# Altium project span-ion-cfd-respin-noMuxDemux.PrjPcb
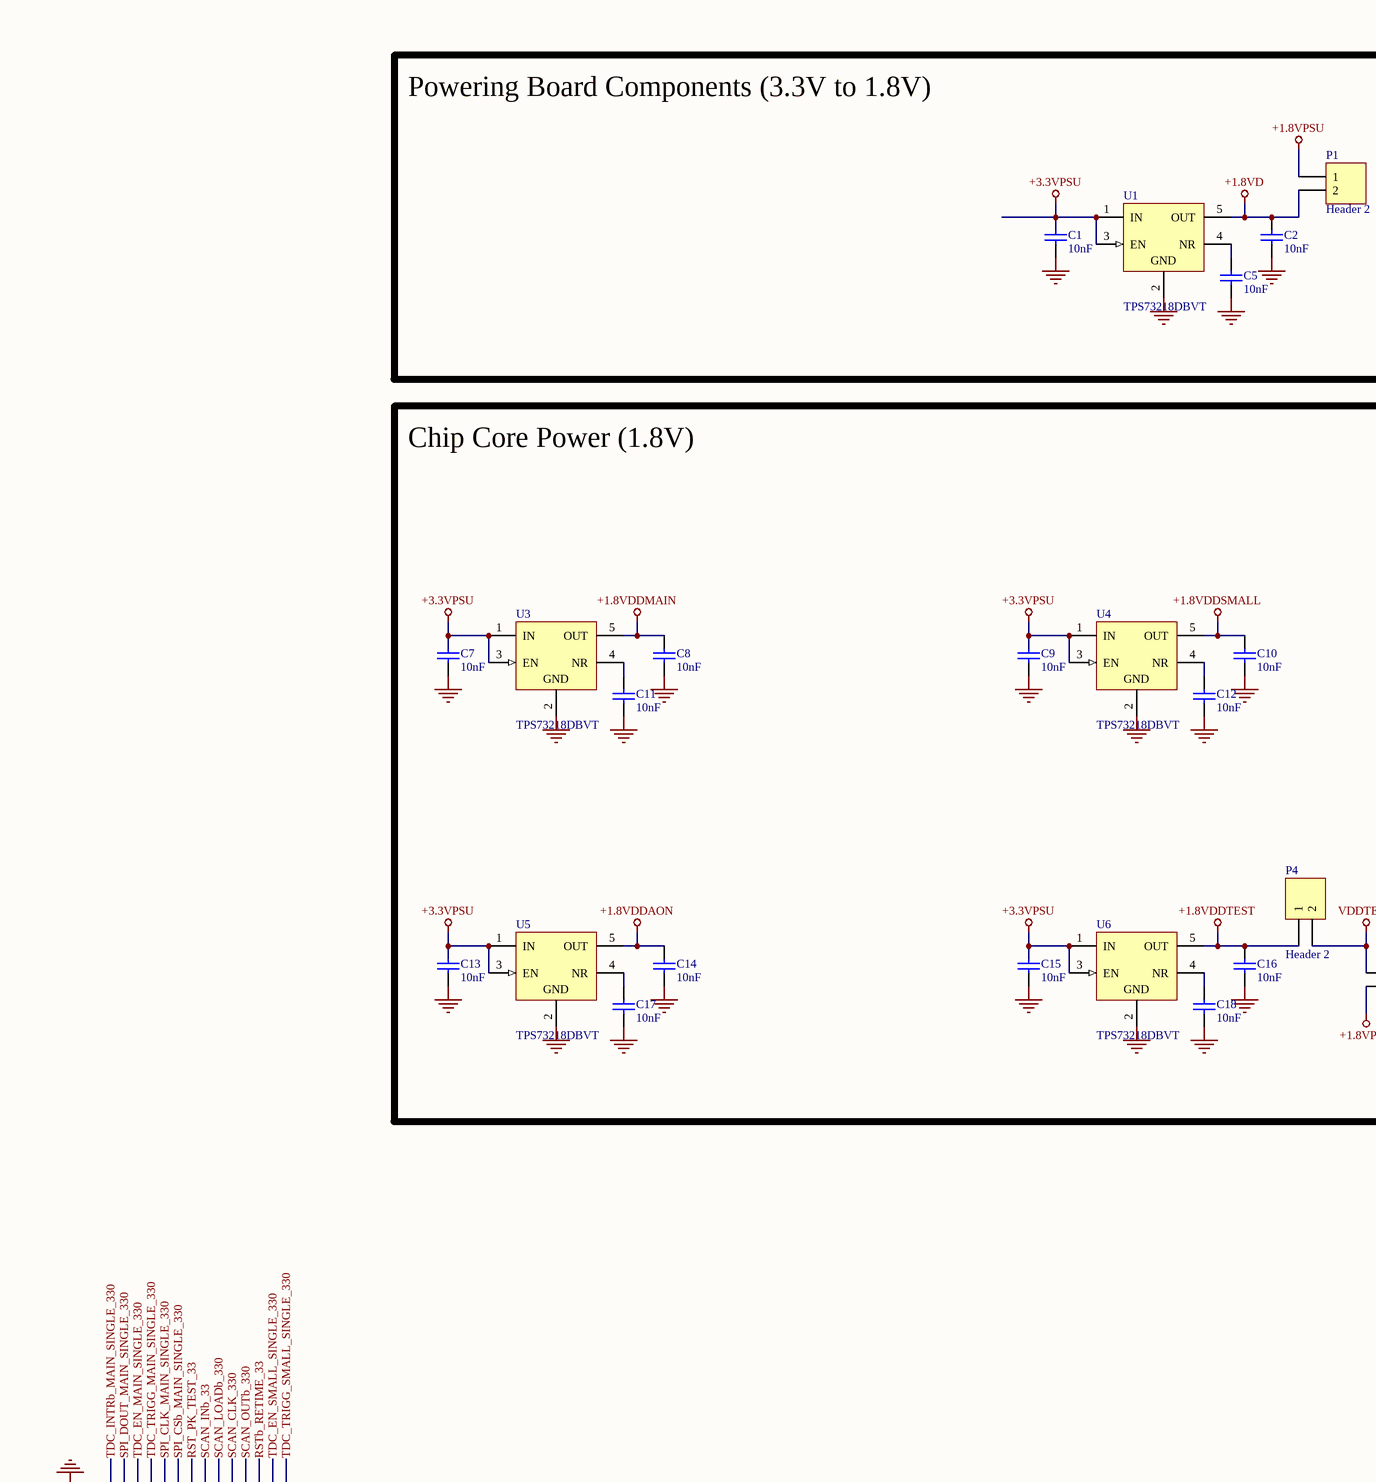
[diagram p0: Shared.SchDoc, top left]
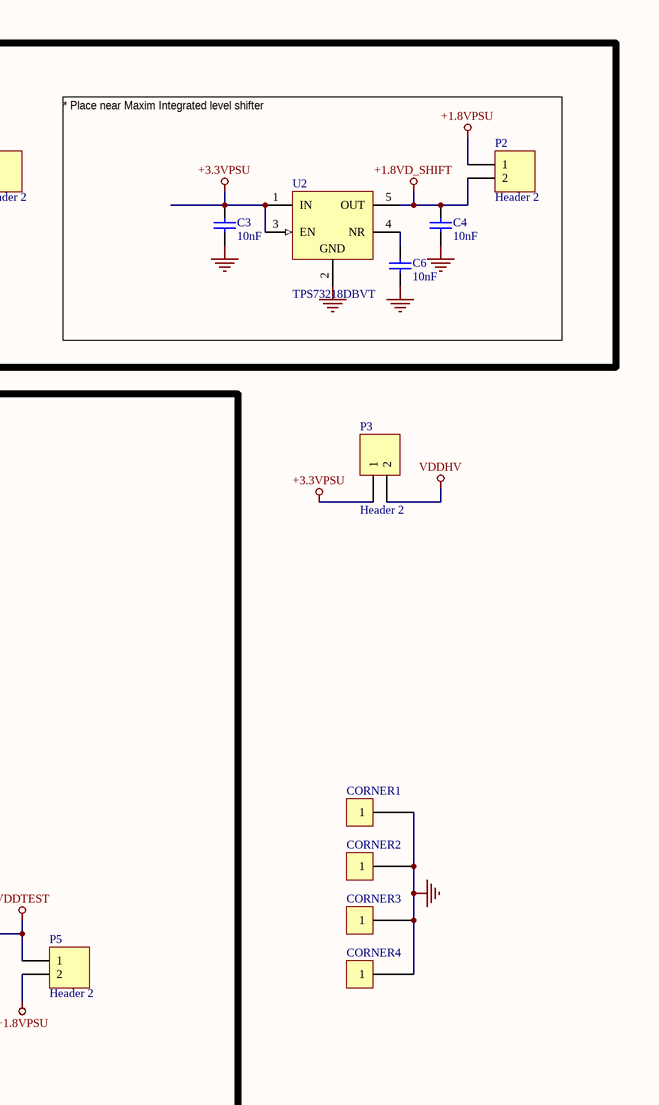
[diagram p1: Shared.SchDoc, top right]
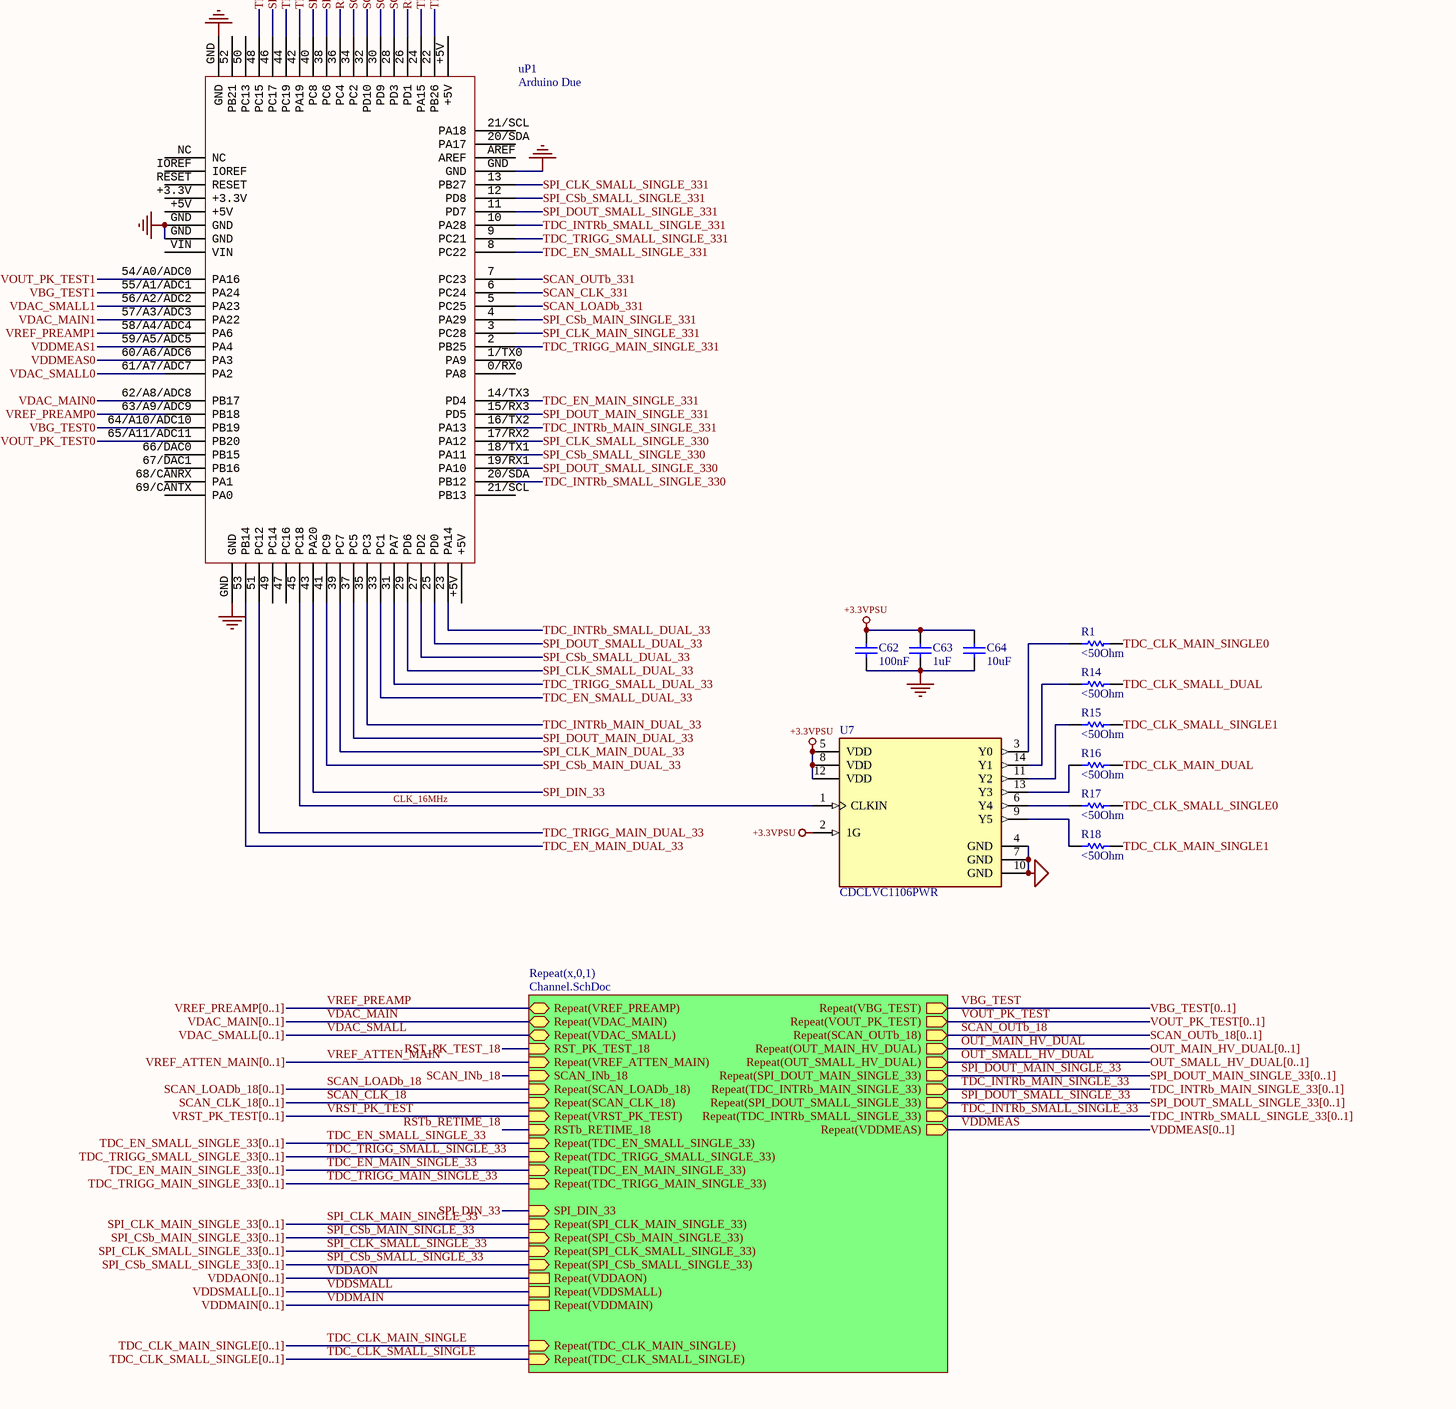
[diagram p2: Shared.SchDoc, bottom left]
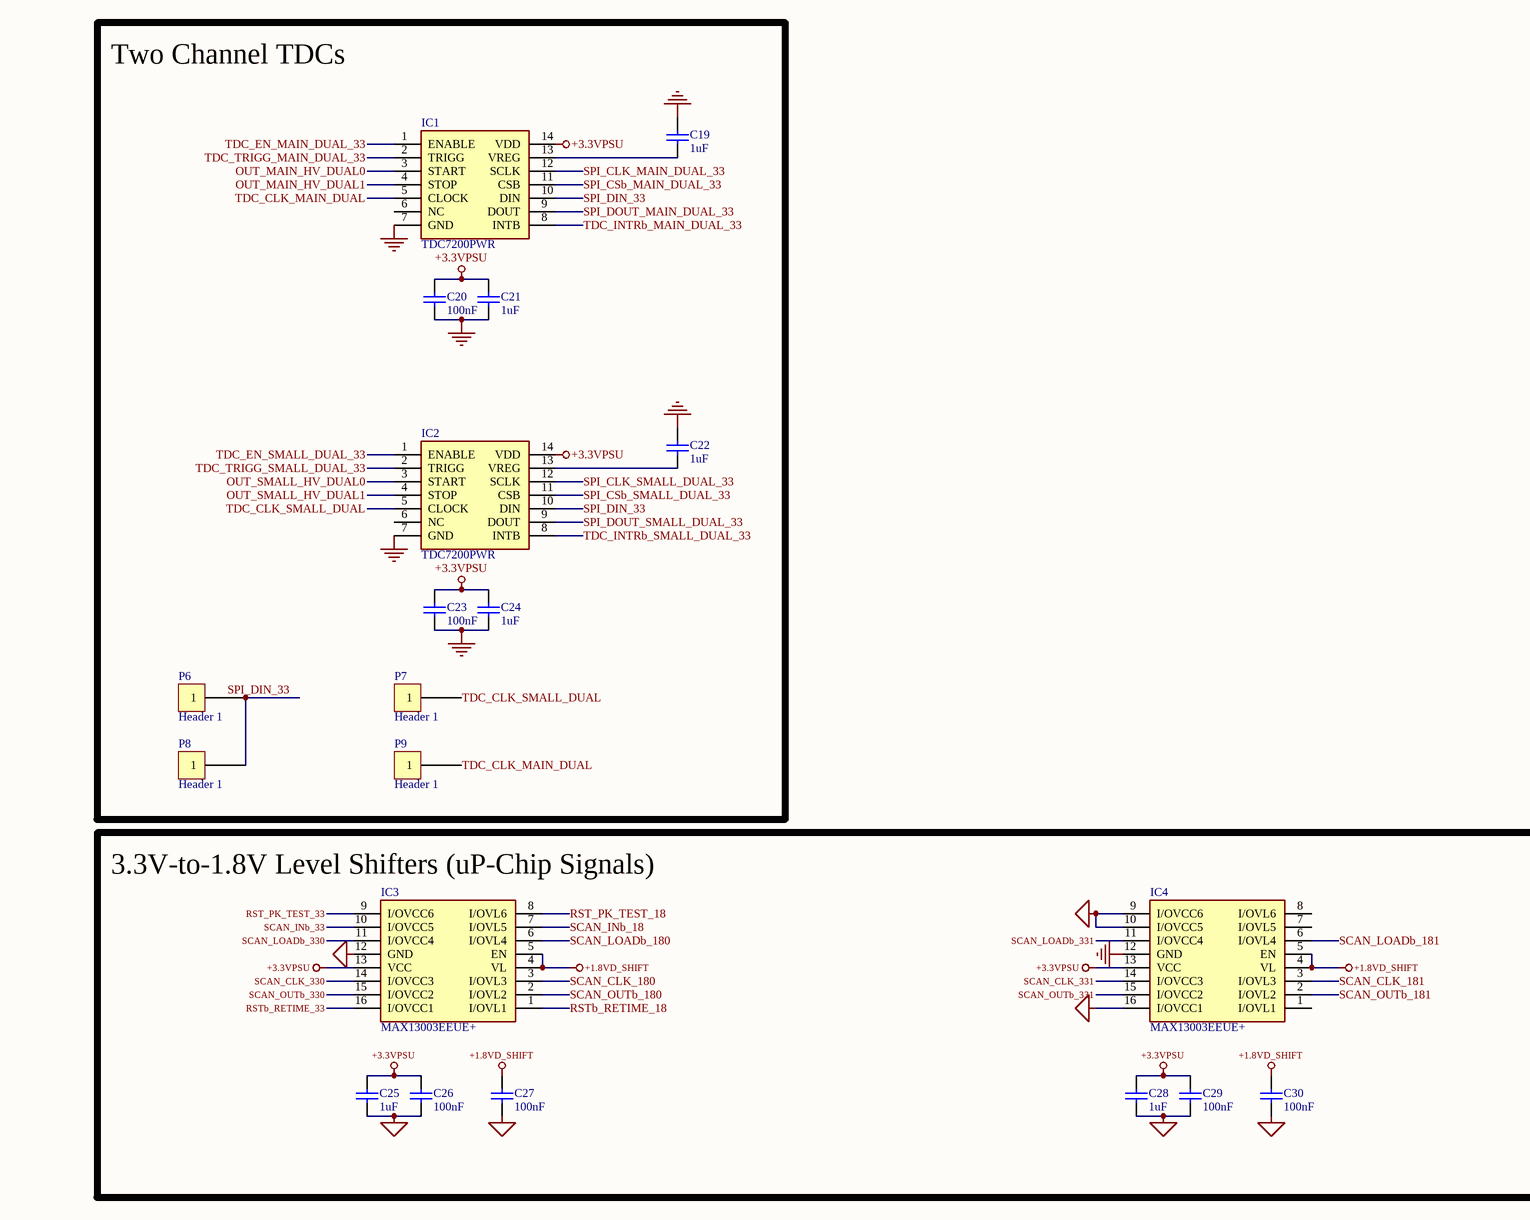
[diagram p3: Shared.SchDoc, bottom right]
2 sheets, 216 parts. Net scope: hierarchical (ports join the sheet entries above them; power ports are global).
Board file: CFD_2Channel.PcbDoc
Sheets:
  Shared.SchDoc
    x0 = Channel.SchDoc
    x1 = Channel.SchDoc

## Sheet Shared.SchDoc
size OrCAD E; SheetNumber: 1; SheetTotal: 2

### Parts
C1  10nF  [CAPC1608X90X35ML10T15]
C2  10nF  [CAPC1608X90X35ML10T15]
C3  10nF  [CAPC1608X90X35ML10T15]
C4  10nF  [CAPC1608X90X35ML10T15]
C5  10nF  [CAPC1608X90X35ML10T15]
C6  10nF  [CAPC1608X90X35ML10T15]
C7  10nF  [CAPC1608X90X35ML10T15]
C8  10nF  [CAPC1608X90X35ML10T15]
C9  10nF  [CAPC1608X90X35ML10T15]
C10  10nF  [CAPC1608X90X35ML10T15]
C11  10nF  [CAPC1608X90X35ML10T15]
C12  10nF  [CAPC1608X90X35ML10T15]
C13  10nF  [CAPC1608X90X35ML10T15]
C14  10nF  [CAPC1608X90X35ML10T15]
C15  10nF  [CAPC1608X90X35ML10T15]
C16  10nF  [CAPC1608X90X35ML10T15]
C17  10nF  [CAPC1608X90X35ML10T15]
C18  10nF  [CAPC1608X90X35ML10T15]
C19  1uF  [CAPC1608X90X35ML10T15]
C20  100nF  [CAPC1608X90X35ML10T15]
C21  1uF  [CAPC1608X90X35ML10T15]
C22  1uF  [CAPC1608X90X35ML10T15]
C23  100nF  [CAPC1608X90X35ML10T15]
C24  1uF  [CAPC1608X90X35ML10T15]
C25  1uF  [CAPC1608X90X35ML10T15]
C26  100nF  [CAPC1608X90X35ML10T15]
C27  100nF  [CAPC1608X90X35ML10T15]
C28  1uF  [CAPC1608X90X35ML10T15]
C29  100nF  [CAPC1608X90X35ML10T15]
C30  100nF  [CAPC1608X90X35ML10T15]
C62  100nF  [CAPC1608X90X35ML10T15]
C63  1uF  [CAPC1608X90X35ML10T15]
C64  10uF  [CAPC1608X90X35ML10T15]
CORNER1  Corner Mount  [CornerMount]  (value not drawn)
CORNER2  Corner Mount  [CornerMount]  (value not drawn)
CORNER3  Corner Mount  [CornerMount]  (value not drawn)
CORNER4  Corner Mount  [CornerMount]  (value not drawn)
IC1  TDC7200PWR  [SOP65P640X120-14N]
IC2  TDC7200PWR  [SOP65P640X120-14N]
IC3  MAX13003EEUE+  [SOP65P640X110-16N]
IC4  MAX13003EEUE+  [SOP65P640X110-16N]
P1  Header 2  [HDR1X2]
P2  Header 2  [HDR1X2]
P3  Header 2  [HDR1X2]
P4  Header 2  [HDR1X2]
P5  Header 2  [HDR1X2]
P6  Header 1  [Header1]
P7  Header 1  [Header1]
P8  Header 1  [Header1]
P9  Header 1  [Header1]
R1  <50Ohm  [RESC1609X50X30NL8T20]
R14  <50Ohm  [RESC1609X50X30NL8T20]
R15  <50Ohm  [RESC1609X50X30NL8T20]
R16  <50Ohm  [RESC1609X50X30NL8T20]
R17  <50Ohm  [RESC1609X50X30NL8T20]
R18  <50Ohm  [RESC1609X50X30NL8T20]
U1  TPS73218DBVT  [DBV0005A_N]
U2  TPS73218DBVT  [DBV0005A_N]
U3  TPS73218DBVT  [DBV0005A_N]
U4  TPS73218DBVT  [DBV0005A_N]
U5  TPS73218DBVT  [DBV0005A_N]
U6  TPS73218DBVT  [DBV0005A_N]
U7  CDCLVC1106PWR  [FP-PW0014A-MFG]
uP1  Arduino Due  [Arduino Due]

### Blocks framed on the sheet
Powering Board Components (3.3V to 1.8V): C1-C6 P1 P2 U1 U2
Chip Core Power (1.8V): C7-C18 P4 P5 U3-U6
Two Channel TDCs: C19-C24 IC1 IC2 P6-P9
3.3V-to-1.8V Level Shifters (uP-Chip Signals): C25-C30 IC3 IC4

### Sub-sheets
Repeat(x,0,1) = Channel.SchDoc: Repeat(VREF_PREAMP) (bidir), Repeat(VDAC_MAIN) (bidir), Repeat(VDAC_SMALL) (bidir), RST_PK_TEST_18 (in), Repeat(VREF_ATTEN_MAIN) (in), SCAN_INb_18 (in), Repeat(SCAN_LOADb_18) (in), Repeat(VBG_TEST) (out), Repeat(VOUT_PK_TEST) (out), Repeat(SCAN_CLK_18) (in), Repeat(VRST_PK_TEST) (in), Repeat(SCAN_OUTb_18) (out), Repeat(OUT_MAIN_HV_DUAL) (out), Repeat(OUT_SMALL_HV_DUAL) (out), RSTb_RETIME_18 (in), Repeat(TDC_EN_SMALL_SINGLE_33) (in), Repeat(TDC_TRIGG_SMALL_SINGLE_33) (in), Repeat(TDC_EN_MAIN_SINGLE_33) (in), Repeat(TDC_TRIGG_MAIN_SINGLE_33) (in), SPI_DIN_33 (in), Repeat(SPI_CLK_MAIN_SINGLE_33) (in), Repeat(SPI_DOUT_MAIN_SINGLE_33) (out), Repeat(SPI_CSb_MAIN_SINGLE_33) (in), Repeat(TDC_INTRb_MAIN_SINGLE_33) (out), Repeat(SPI_CLK_SMALL_SINGLE_33) (in), Repeat(SPI_DOUT_SMALL_SINGLE_33) (out), Repeat(SPI_CSb_SMALL_SINGLE_33) (in), Repeat(TDC_INTRb_SMALL_SINGLE_33) (out), Repeat(VDDAON), Repeat(VDDSMALL), Repeat(VDDMAIN), Repeat(VDDMEAS) (out), Repeat(TDC_CLK_MAIN_SINGLE) (in), Repeat(TDC_CLK_SMALL_SINGLE) (in)

### Nets
+1.8VD: C2.1 P1.2 U1.5(OUT)
+1.8VD_SHIFT: C4.1 C27.1 C30.1 IC3.4(VL) IC3.5(EN) IC4.4(VL) IC4.5(EN) P2.2 U2.5(OUT)
+1.8VDDAON: C14.1 U5.5(OUT)
+1.8VDDMAIN: C8.1 U3.5(OUT)
+1.8VDDSMALL: C10.1 U4.5(OUT)
+1.8VDDTEST: C16.1 P4.1 U6.5(OUT)
+1.8VPSU: P1.1 P2.1 P5.2
+3.3VPSU: C1.1 C3.1 C7.1 C9.1 C13.1 C15.1 C20.1 C21.1 C23.1 C24.1 C25.2 C26.2 C28.2 C29.2 C62.1 C63.1 C64.1 IC1.14(VDD) IC2.14(VDD) IC3.13(VCC) IC4.13(VCC) P3.1 U1.1(IN) U1.3(EN) U2.1(IN) U2.3(EN) U3.1(IN) U3.3(EN) U4.1(IN) U4.3(EN) U5.1(IN) U5.3(EN) U6.1(IN) U6.3(EN) U7.2(1G) U7.5(VDD) U7.8(VDD) U7.12(VDD)
GND: C1.2 C2.2 C3.2 C4.2 C5.2 C6.2 C7.2 C8.2 C9.2 C10.2 C11.2 C12.2 C13.2 C14.2 C15.2 C16.2 C17.2 C18.2 C19.2 C20.2 C21.2 C22.2 C23.2 C24.2 C25.1 C26.1 C27.2 C28.1 C29.1 C30.2 C62.2 C63.2 C64.2 CORNER1.1 CORNER2.1 CORNER3.1 CORNER4.1 IC1.7(GND) IC2.7(GND) IC3.12(GND) IC4.9(I/OVCC6) IC4.10(I/OVCC5) IC4.12(GND) IC4.16(I/OVCC1) U1.2(GND) U2.2(GND) U3.2(GND) U4.2(GND) U5.2(GND) U6.2(GND) U7.4(GND) U7.7(GND) U7.10(GND) uP1.GND
VDDHV: P3.2
VDDTEST: P4.2 P5.1
CLK_16MHz: U7.1(CLKIN) uP1.45(PC18)
OUT_MAIN_HV_DUAL: sheet Repeat(x,0,1)/Repeat(OUT_MAIN_HV_DUAL)
OUT_MAIN_HV_DUAL0: IC1.3(START)
OUT_MAIN_HV_DUAL1: IC1.4(STOP)
OUT_SMALL_HV_DUAL: sheet Repeat(x,0,1)/Repeat(OUT_SMALL_HV_DUAL)
OUT_SMALL_HV_DUAL0: IC2.3(START)
OUT_SMALL_HV_DUAL1: IC2.4(STOP)
RST_PK_TEST_18: IC3.8(I/OVL6) ; sheet Repeat(x,0,1)/RST_PK_TEST_18
RST_PK_TEST_33: IC3.9(I/OVCC6) uP1.36(PC4)
RSTb_RETIME_18: IC3.1(I/OVL1) ; sheet Repeat(x,0,1)/RSTb_RETIME_18
RSTb_RETIME_33: IC3.16(I/OVCC1) uP1.26(PD1)
SCAN_CLK_18: sheet Repeat(x,0,1)/Repeat(SCAN_CLK_18)
SCAN_CLK_180: IC3.3(I/OVL3)
SCAN_CLK_181: IC4.3(I/OVL3)
SCAN_CLK_330: IC3.14(I/OVCC3) uP1.30(PD9)
SCAN_CLK_331: IC4.14(I/OVCC3) uP1.6(PC24)
SCAN_INb_18: IC3.7(I/OVL5) ; sheet Repeat(x,0,1)/SCAN_INb_18
SCAN_INb_33: IC3.10(I/OVCC5) uP1.34(PC2)
SCAN_LOADb_18: sheet Repeat(x,0,1)/Repeat(SCAN_LOADb_18)
SCAN_LOADb_180: IC3.6(I/OVL4)
SCAN_LOADb_181: IC4.6(I/OVL4)
SCAN_LOADb_330: IC3.11(I/OVCC4) uP1.32(PD10)
SCAN_LOADb_331: IC4.11(I/OVCC4) uP1.5(PC25)
SCAN_OUTb_18: sheet Repeat(x,0,1)/Repeat(SCAN_OUTb_18)
SCAN_OUTb_180: IC3.2(I/OVL2)
SCAN_OUTb_181: IC4.2(I/OVL2)
SCAN_OUTb_330: IC3.15(I/OVCC2) uP1.28(PD3)
SCAN_OUTb_331: IC4.15(I/OVCC2) uP1.7(PC23)
SPI_CLK_MAIN_DUAL_33: IC1.12(SCLK) uP1.39(PC7)
SPI_CLK_MAIN_SINGLE_33: sheet Repeat(x,0,1)/Repeat(SPI_CLK_MAIN_SINGLE_33)
SPI_CLK_MAIN_SINGLE_330: uP1.40(PC8)
SPI_CLK_MAIN_SINGLE_331: uP1.3(PC28)
SPI_CLK_SMALL_DUAL_33: IC2.12(SCLK) uP1.29(PD6)
SPI_CLK_SMALL_SINGLE_33: sheet Repeat(x,0,1)/Repeat(SPI_CLK_SMALL_SINGLE_33)
SPI_CLK_SMALL_SINGLE_330: uP1.17/RX2(PA12)
SPI_CLK_SMALL_SINGLE_331: uP1.13(PB27)
SPI_CSb_MAIN_DUAL_33: IC1.11(CSB) uP1.41(PC9)
SPI_CSb_MAIN_SINGLE_33: sheet Repeat(x,0,1)/Repeat(SPI_CSb_MAIN_SINGLE_33)
SPI_CSb_MAIN_SINGLE_330: uP1.38(PC6)
SPI_CSb_MAIN_SINGLE_331: uP1.4(PA29)
SPI_CSb_SMALL_DUAL_33: IC2.11(CSB) uP1.27(PD2)
SPI_CSb_SMALL_SINGLE_33: sheet Repeat(x,0,1)/Repeat(SPI_CSb_SMALL_SINGLE_33)
SPI_CSb_SMALL_SINGLE_330: uP1.18/TX1(PA11)
SPI_CSb_SMALL_SINGLE_331: uP1.12(PD8)
SPI_DIN_33: IC1.10(DIN) IC2.10(DIN) P6.1 P8.1 uP1.43(PA20) ; sheet Repeat(x,0,1)/SPI_DIN_33
SPI_DOUT_MAIN_DUAL_33: IC1.9(DOUT) uP1.37(PC5)
SPI_DOUT_MAIN_SINGLE_33: sheet Repeat(x,0,1)/Repeat(SPI_DOUT_MAIN_SINGLE_33)
SPI_DOUT_MAIN_SINGLE_330: uP1.46(PC17)
SPI_DOUT_MAIN_SINGLE_331: uP1.15/RX3(PD5)
SPI_DOUT_SMALL_DUAL_33: IC2.9(DOUT) uP1.25(PD0)
SPI_DOUT_SMALL_SINGLE_33: sheet Repeat(x,0,1)/Repeat(SPI_DOUT_SMALL_SINGLE_33)
SPI_DOUT_SMALL_SINGLE_330: uP1.19/RX1(PA10)
SPI_DOUT_SMALL_SINGLE_331: uP1.11(PD7)
TDC_CLK_MAIN_DUAL: IC1.5(CLOCK) P9.1 R16.1
TDC_CLK_MAIN_SINGLE: sheet Repeat(x,0,1)/Repeat(TDC_CLK_MAIN_SINGLE)
TDC_CLK_MAIN_SINGLE0: R1.1  [project net TDC_CLK_MAIN_SINGLE]
TDC_CLK_MAIN_SINGLE1: R18.1  [project net TDC_CLK_MAIN_SINGLE]
TDC_CLK_SMALL_DUAL: IC2.5(CLOCK) P7.1 R14.1
TDC_CLK_SMALL_SINGLE: sheet Repeat(x,0,1)/Repeat(TDC_CLK_SMALL_SINGLE)
TDC_CLK_SMALL_SINGLE0: R17.1  [project net TDC_CLK_SMALL_SINGLE]
TDC_CLK_SMALL_SINGLE1: R15.1  [project net TDC_CLK_SMALL_SINGLE]
TDC_EN_MAIN_DUAL_33: IC1.1(ENABLE) uP1.53(PB14)
TDC_EN_MAIN_SINGLE_33: sheet Repeat(x,0,1)/Repeat(TDC_EN_MAIN_SINGLE_33)
TDC_EN_MAIN_SINGLE_330: uP1.44(PC19)
TDC_EN_MAIN_SINGLE_331: uP1.14/TX3(PD4)
TDC_EN_SMALL_DUAL_33: IC2.1(ENABLE) uP1.33(PC1)
TDC_EN_SMALL_SINGLE_33: sheet Repeat(x,0,1)/Repeat(TDC_EN_SMALL_SINGLE_33)
TDC_EN_SMALL_SINGLE_330: uP1.24(PA15)
TDC_EN_SMALL_SINGLE_331: uP1.8(PC22)
TDC_INTRb_MAIN_DUAL_33: IC1.8(INTB) uP1.35(PC3)
TDC_INTRb_MAIN_SINGLE_33: sheet Repeat(x,0,1)/Repeat(TDC_INTRb_MAIN_SINGLE_33)
TDC_INTRb_MAIN_SINGLE_330: uP1.48(PC15)
TDC_INTRb_MAIN_SINGLE_331: uP1.16/TX2(PA13)
TDC_INTRb_SMALL_DUAL_33: IC2.8(INTB) uP1.23(PA14)
TDC_INTRb_SMALL_SINGLE_33: sheet Repeat(x,0,1)/Repeat(TDC_INTRb_SMALL_SINGLE_33)
TDC_INTRb_SMALL_SINGLE_330: uP1.20/SDA(PA17)
TDC_INTRb_SMALL_SINGLE_331: uP1.10(PA28)
TDC_TRIGG_MAIN_DUAL_33: IC1.2(TRIGG) uP1.51(PC12)
TDC_TRIGG_MAIN_SINGLE_33: sheet Repeat(x,0,1)/Repeat(TDC_TRIGG_MAIN_SINGLE_33)
TDC_TRIGG_MAIN_SINGLE_330: uP1.42(PA19)
TDC_TRIGG_MAIN_SINGLE_331: uP1.2(PB25)
TDC_TRIGG_SMALL_DUAL_33: IC2.2(TRIGG) uP1.31(PA7)
TDC_TRIGG_SMALL_SINGLE_33: sheet Repeat(x,0,1)/Repeat(TDC_TRIGG_SMALL_SINGLE_33)
TDC_TRIGG_SMALL_SINGLE_330: uP1.22(PB26)
TDC_TRIGG_SMALL_SINGLE_331: uP1.9(PC21)
VBG_TEST: sheet Repeat(x,0,1)/Repeat(VBG_TEST)
VBG_TEST0: uP1.64/A10/ADC10(PB19)  [project net VBG_TEST]
VBG_TEST1: uP1.55/A1/ADC1(PA24)  [project net VBG_TEST]
VDAC_MAIN: sheet Repeat(x,0,1)/Repeat(VDAC_MAIN)
VDAC_MAIN0: uP1.62/A8/ADC8(PB17)  [project net VDAC_MAIN]
VDAC_MAIN1: uP1.57/A3/ADC3(PA22)  [project net VDAC_MAIN]
VDAC_SMALL: sheet Repeat(x,0,1)/Repeat(VDAC_SMALL)
VDAC_SMALL0: uP1.61/A7/ADC7(PA2)  [project net VDAC_SMALL]
VDAC_SMALL1: uP1.56/A2/ADC2(PA23)  [project net VDAC_SMALL]
VDDAON: sheet Repeat(x,0,1)/Repeat(VDDAON)
VDDMAIN: sheet Repeat(x,0,1)/Repeat(VDDMAIN)
VDDMEAS: sheet Repeat(x,0,1)/Repeat(VDDMEAS)
VDDMEAS0: uP1.60/A6/ADC6(PA3)  [project net VDDMEAS]
VDDMEAS1: uP1.59/A5/ADC5(PA4)  [project net VDDMEAS]
VDDSMALL: sheet Repeat(x,0,1)/Repeat(VDDSMALL)
VOUT_PK_TEST: sheet Repeat(x,0,1)/Repeat(VOUT_PK_TEST)
VOUT_PK_TEST0: uP1.65/A11/ADC11(PB20)
VOUT_PK_TEST1: uP1.54/A0/ADC0(PA16)
VREF_ATTEN_MAIN: sheet Repeat(x,0,1)/Repeat(VREF_ATTEN_MAIN)
VREF_PREAMP: sheet Repeat(x,0,1)/Repeat(VREF_PREAMP)
VREF_PREAMP0: uP1.63/A9/ADC9(PB18)  [project net VREF_PREAMP]
VREF_PREAMP1: uP1.58/A4/ADC4(PA6)  [project net VREF_PREAMP]
VRST_PK_TEST: sheet Repeat(x,0,1)/Repeat(VRST_PK_TEST)
NetC5_1: C5.1 U1.4(NR)
NetC6_1: C6.1 U2.4(NR)
NetC11_1: C11.1 U3.4(NR)
NetC12_1: C12.1 U4.4(NR)
NetC17_1: C17.1 U5.4(NR)
NetC18_1: C18.1 U6.4(NR)
NetC19_1: C19.1 IC1.13(VREG)
NetC22_1: C22.1 IC2.13(VREG)
NetR1_2: R1.2 U7.3(Y0)
NetR14_2: R14.2 U7.14(Y1)
NetR15_2: R15.2 U7.11(Y2)
NetR16_2: R16.2 U7.13(Y3)
NetR17_2: R17.2 U7.6(Y4)
NetR18_2: R18.2 U7.9(Y5)

Not connected (* = marked no-connect by the designer): IC1 6(NC); IC2 6(NC); IC4 1(I/OVL1) 7(I/OVL5) 8(I/OVL6); uP1 0/RX0(PA8) 1/TX0(PA9) 21/SCL(PA18) 47(PC16) 49(PC14) 50(PC13) 52(PB21) 66/DAC0(PB15) 67/DAC1(PB16) 68/CANRX(PA1) 69/CANTX(PA0) +3.3V +5V AREF IOREF NC RESET VIN

### Buses and harness runs
bus OUT_MAIN_HV_DUAL[0..1]
bus OUT_SMALL_HV_DUAL[0..1]
bus SCAN_CLK_18[0..1]
bus SCAN_LOADb_18[0..1]
bus SCAN_OUTb_18[0..1]
bus SPI_CLK_MAIN_SINGLE_33[0..1]
bus SPI_CLK_SMALL_SINGLE_33[0..1]
bus SPI_CSb_MAIN_SINGLE_33[0..1]
bus SPI_CSb_SMALL_SINGLE_33[0..1]
bus SPI_DOUT_MAIN_SINGLE_33[0..1]
bus SPI_DOUT_SMALL_SINGLE_33[0..1]
bus TDC_CLK_MAIN_SINGLE[0..1]
bus TDC_CLK_SMALL_SINGLE[0..1]
bus TDC_EN_MAIN_SINGLE_33[0..1]
bus TDC_EN_SMALL_SINGLE_33[0..1]
bus TDC_INTRb_MAIN_SINGLE_33[0..1]
bus TDC_INTRb_SMALL_SINGLE_33[0..1]
bus TDC_TRIGG_MAIN_SINGLE_33[0..1]
bus TDC_TRIGG_SMALL_SINGLE_33[0..1]
bus VBG_TEST[0..1]
bus VDAC_MAIN[0..1]
bus VDAC_SMALL[0..1]
bus VDDAON[0..1]
bus VDDMAIN[0..1]
bus VDDMEAS[0..1]
bus VDDSMALL[0..1]
bus VOUT_PK_TEST[0..1]
bus VREF_ATTEN_MAIN[0..1]
bus VREF_PREAMP[0..1]
bus VRST_PK_TEST[0..1]

### Notes on the sheet
- * Place near Maxim Integrated level shifter

### Library data of the parts
C1-C18 = CMP-2000-04945-1: 0603,10nF; Manufacturer: Murata; Capacitance: 22pF; Tolerance (%): ±5%; Rated Voltage: 50V; Dielectric: C0G; Manufacturer URL: http://www.murata.com/; Datasheet Version: Jul-06; Package Reference: 603; Case Size/Dimension: 0603; Package Description: 2-Pin Surface Mount Device, Body 1.6 x 0.8 mm; Datasheet URL: https://datasheet.ciiva.com/11786/0900766b807a1cab-11786398.pdf
C19 C21 C22 C24 C25 C28 C63 = CMP-2000-04945-1: 0603,1uF; Manufacturer: Murata; Capacitance: 22pF; Tolerance (%): ±5%; Rated Voltage: 50V; Dielectric: C0G; Manufacturer URL: http://www.murata.com/; Datasheet Version: Jul-06; Package Reference: 603; Case Size/Dimension: 0603; Package Description: 2-Pin Surface Mount Device, Body 1.6 x 0.8 mm; Datasheet URL: https://datasheet.ciiva.com/11786/0900766b807a1cab-11786398.pdf
C20 C23 C26 C27 C29 C30 C62 = CMP-2000-04945-1: 0603,100nF; Manufacturer: Murata; Capacitance: 22pF; Tolerance (%): ±5%; Rated Voltage: 50V; Dielectric: C0G; Manufacturer URL: http://www.murata.com/; Datasheet Version: Jul-06; Package Reference: 603; Case Size/Dimension: 0603; Package Description: 2-Pin Surface Mount Device, Body 1.6 x 0.8 mm; Datasheet URL: https://datasheet.ciiva.com/11786/0900766b807a1cab-11786398.pdf
C64 = CMP-2000-04945-1: 0603,10uF; Manufacturer: Murata; Capacitance: 22pF; Tolerance (%): ±5%; Rated Voltage: 50V; Dielectric: C0G; Manufacturer URL: http://www.murata.com/; Datasheet Version: Jul-06; Package Reference: 603; Case Size/Dimension: 0603; Package Description: 2-Pin Surface Mount Device, Body 1.6 x 0.8 mm; Datasheet URL: https://datasheet.ciiva.com/11786/0900766b807a1cab-11786398.pdf
IC1 IC2 = TDC7200PWR: Integrated Circuit; Manufacturer_Name: Texas Instruments; Datasheet Link: http://www.ti.com/lit/gpn/tdc7200; Height: 1.2mm; Manufacturer_Part_Number: TDC7200PWR
IC3 IC4 = MAX13003EEUE+: Integrated Circuit; Manufacturer_Name: Maxim Integrated; Datasheet Link: https://pdfserv.maximintegrated.com/en/ds/MAX13000E-MAX13005E.pdf; Height: 1.1mm; Manufacturer_Part_Number: MAX13003EEUE+
P1-P5 = Header 2: Header, 2-Pin; LatestRevisionDate: 17-Jul-2002; LatestRevisionNote: Re-released for DXP Platform.; Publisher: Altium Limited
R1 R14-R18 = CMP-2000-03816-5: 0603,<50Ohm; Manufacturer: Vishay Semiconductor; Voltage Rating: 75 V; Package Quantity: 5000; DatasheetVersion: 06/2012; Min Operating Temperature: -55 degC; ComponentLink1URL: http://www.vishay.com/; Mounting Technology: Surface Mount; Height: 0.45 mm; ComponentLink1Description: Manufacturer URL; REACH SVHC: Unknown; PackageReference: 0603; Packaging: Tape and Reel; Max Operating Temperature: 155 degC; Mount: Surface Mount; ComponentLink2Description: Datasheet; PackageDescription: 2-Pin Surface Mount Device, Body 1.575 x 0.85 mm; Length: 1.55 mm; ComponentLink2URL: http://www.vishay.com/docs/20035/dcrcwe3.pdf; Pins: 2; RoHSCompliant: true
U1-U6 = CMP-0394-00378-2: Single Output Fast Transient Response LDO, 200 mA, Fixed 1.8 V Output, 1.7 to 5.5 V Input, with Reverse Current Protection, 5-pin SOT-23 (DBV), -40 to 85 degC, Green (RoHS & no Sb/Br); Manufacturer: Texas Instruments; Iout(Max)(A): 0.25; Iq(Typ)(mA): 0.4; Accuracy(%): 1; Vout Adj(Min)(V): 1.8; Vdo(Typ)(mV): 40; SubFamily: Single Channel LDO; Vin(Min)(V): 1.7; Vin(Max)(V): 5.5; ComponentLink1URL: http://www.ti.com/; PartNumber: TPS73218DBVT; Eco-Plan: Green (RoHS & no Sb/Br); ComponentLink2Description: Datasheet; PackageVersion: 4073253-4/K; ComponentLink3URL: http://www.ti.com/litv/pdf/mpds018i; ComponentLink3Description: Package Specification; ComponentLink1Description: Manufacturer URL; Vout Adj(Max)(V): 1.8; Code_JEDEC: MO-178; ComponentLink2URL: http://www.ti.com/general/docs/lit/getliterature.tsp?genericPartNumber=TPS73218&fileType=pdf; DatasheetVersion: SBVS037O; Mounting Technology: Surface Mount; PackageReference: DBV0005A; PackageDescription: 5-Pin Plastic Small Outline, Body 1.60 Ãƒâ€” 2.90 mm, Pitch 0.95 mm; Fixed Output Options(V): 1.8
U7 = CMP-04855-000003-1: IC CLK BUFFER 1:6 250MHZ 14TSSOP; Manufacturer: Texas Instruments; Max Supply Voltage: 3.6V; Max Junction Temp: +125°C; Standoff Height: 0.05mm; Number Of Outputs: 6; Number Of Inputs: 1; Nominal Supply Current: 3-6mA; Propagation Delay: 2-2.6ns; Min Supply Voltage: 2.3V; Mouser Description: Clock Buffer Lo Jitter 1:6 LVCMOS Fan-out Clock Bfr; Temperature Range High: +85°C; Device Class L1: Integrated Circuits (ICs); Package: PW0014A; ComponentLink2URL: http://www.ti.com/lit/ds/symlink/cdclvc1106.pdf; Temperature: -40°C to +85°C; Device Class L3: Clock Buffers; Manufacturer Part Number: CDCLVC1106PWR; ComponentLink2Description: Datasheet; Temperature Range Low: -40°C; Category: IC; Ipc Land Pattern Name: SOP65P640X120-14; Height: 1.2mm; Device Class L2: Clock and Timing; RoHS: TRUE; Digikey Description: IC CLK BUFFER 1:6 250MHZ 14TSSOP; Number Of Elements: 1; Lead Free: Yes; Automotive: No; Octopart: https://octopart.com/cdclvc1106pwr-texas+instruments-18629865; Ambient Temperature Range Low: -40°C; Ambient Temperature Range High: +85°C
uP1 = Arduino Due: Header, 10-pin, 8-pin (4x), 18-pin dual row

## Sheet Channel.SchDoc
size OrCAD E; SheetNumber: 2; SheetTotal: 2
Used 2 times, as channels x0, x1. Parts and nets are listed once, with the designators drawn on the sheet.
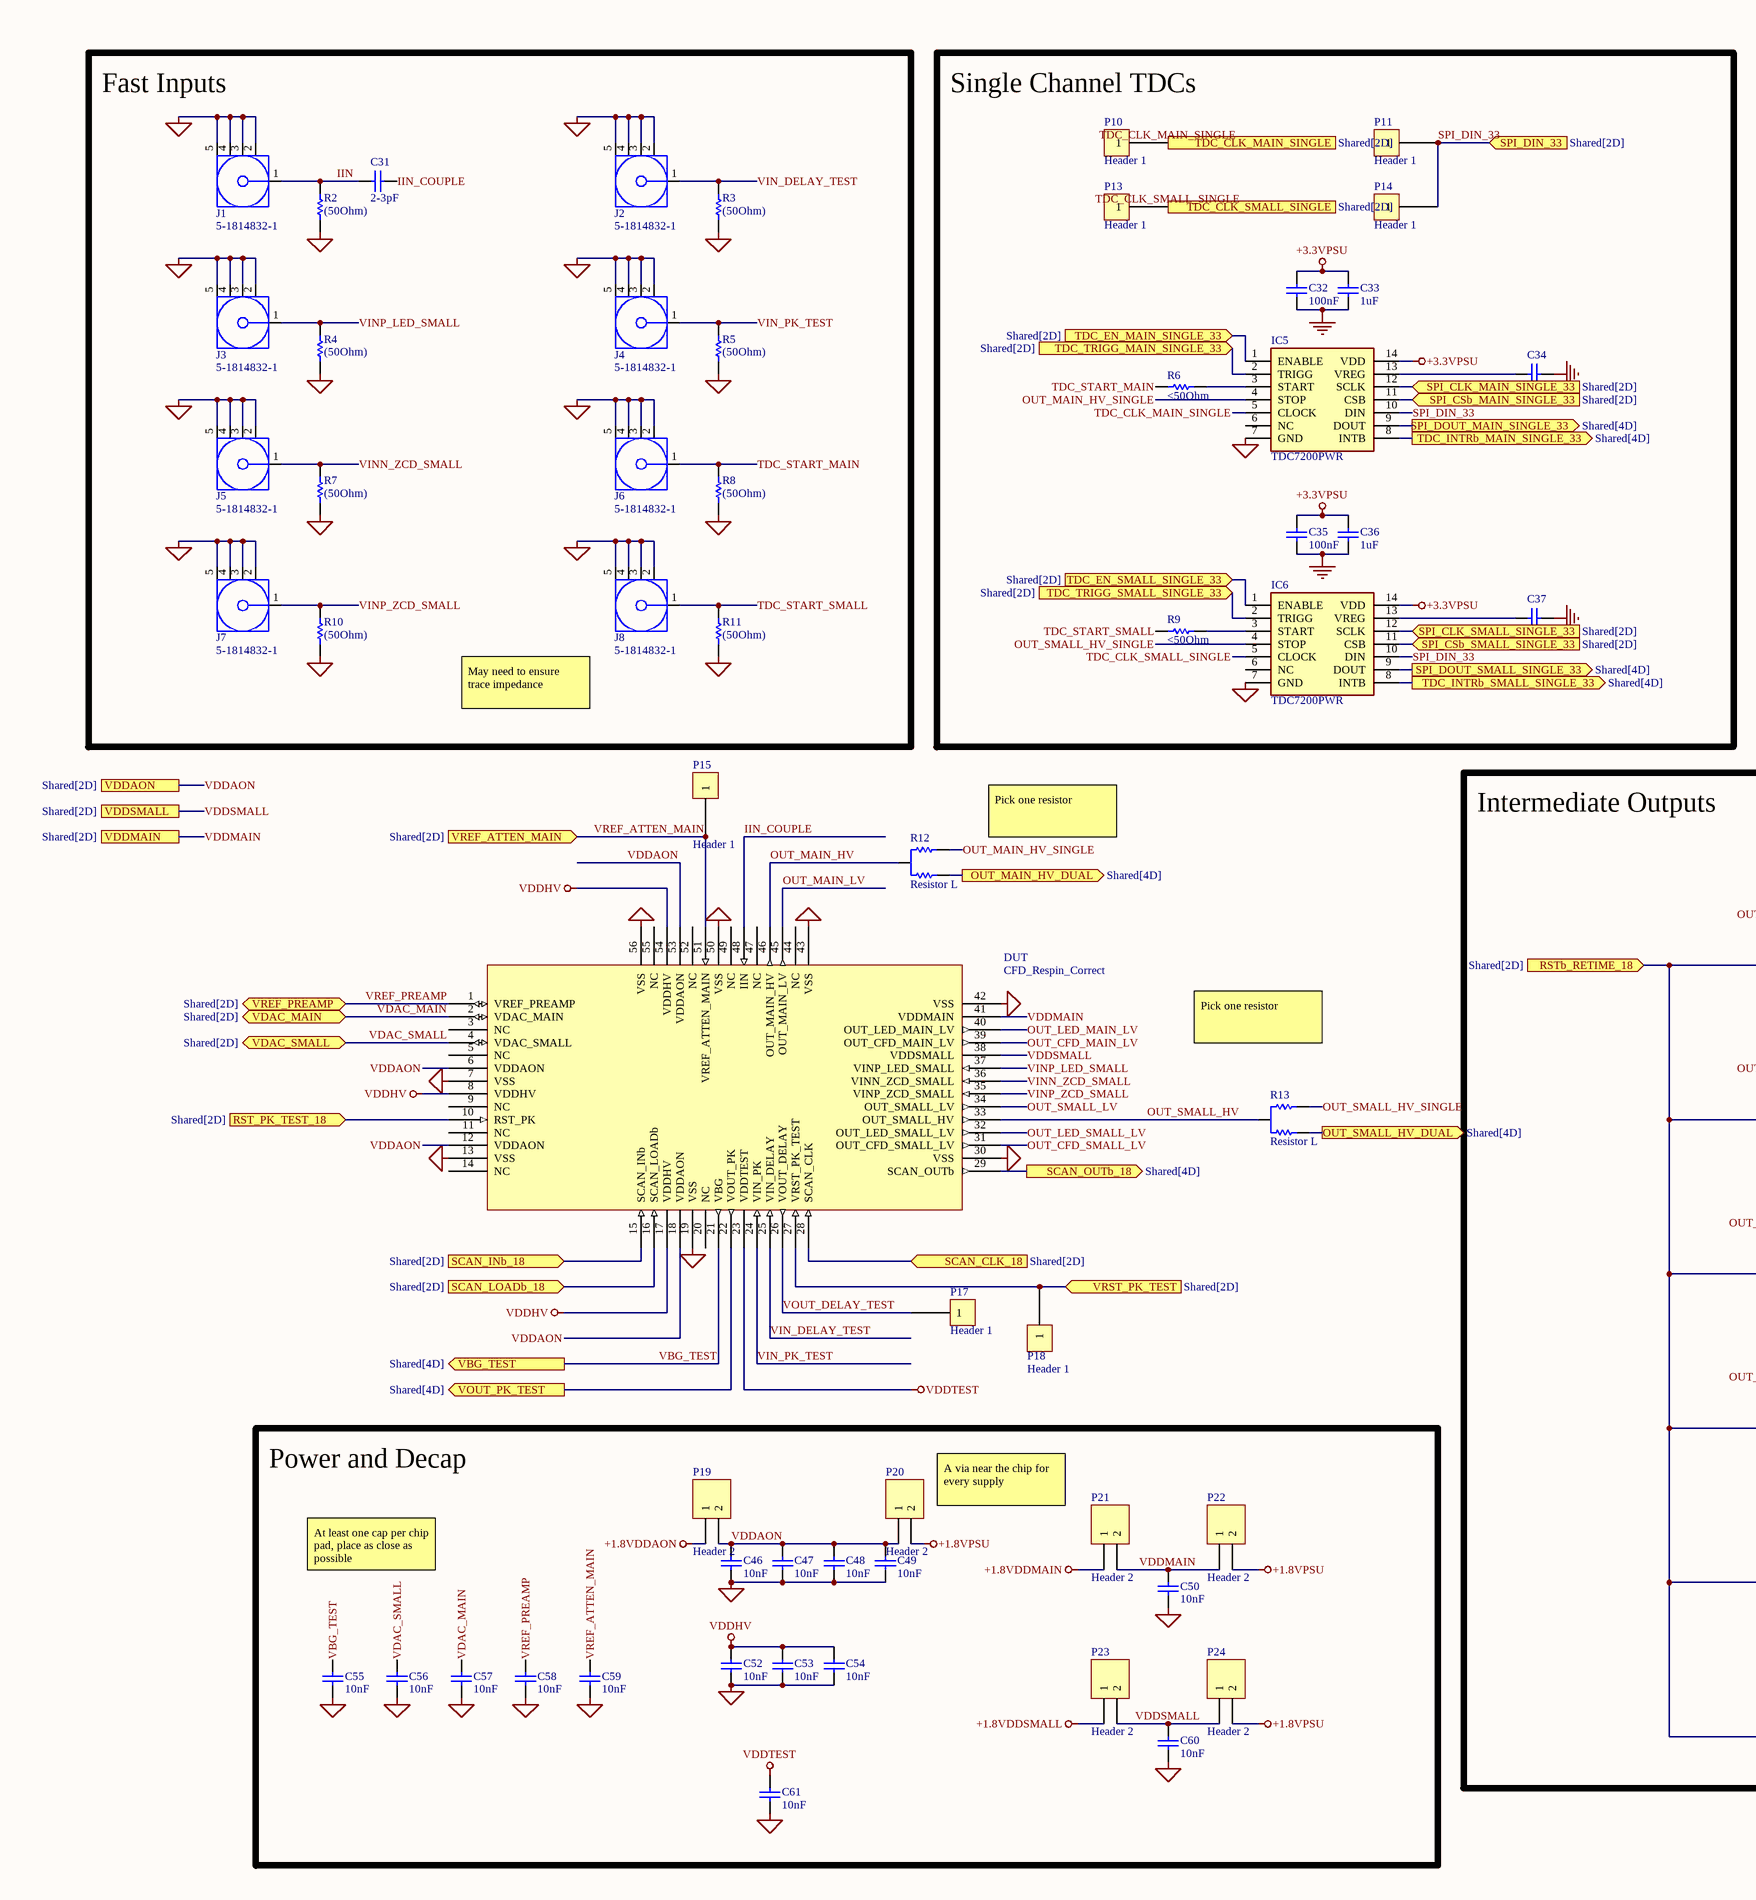
[diagram p4: Channel.SchDoc, left]
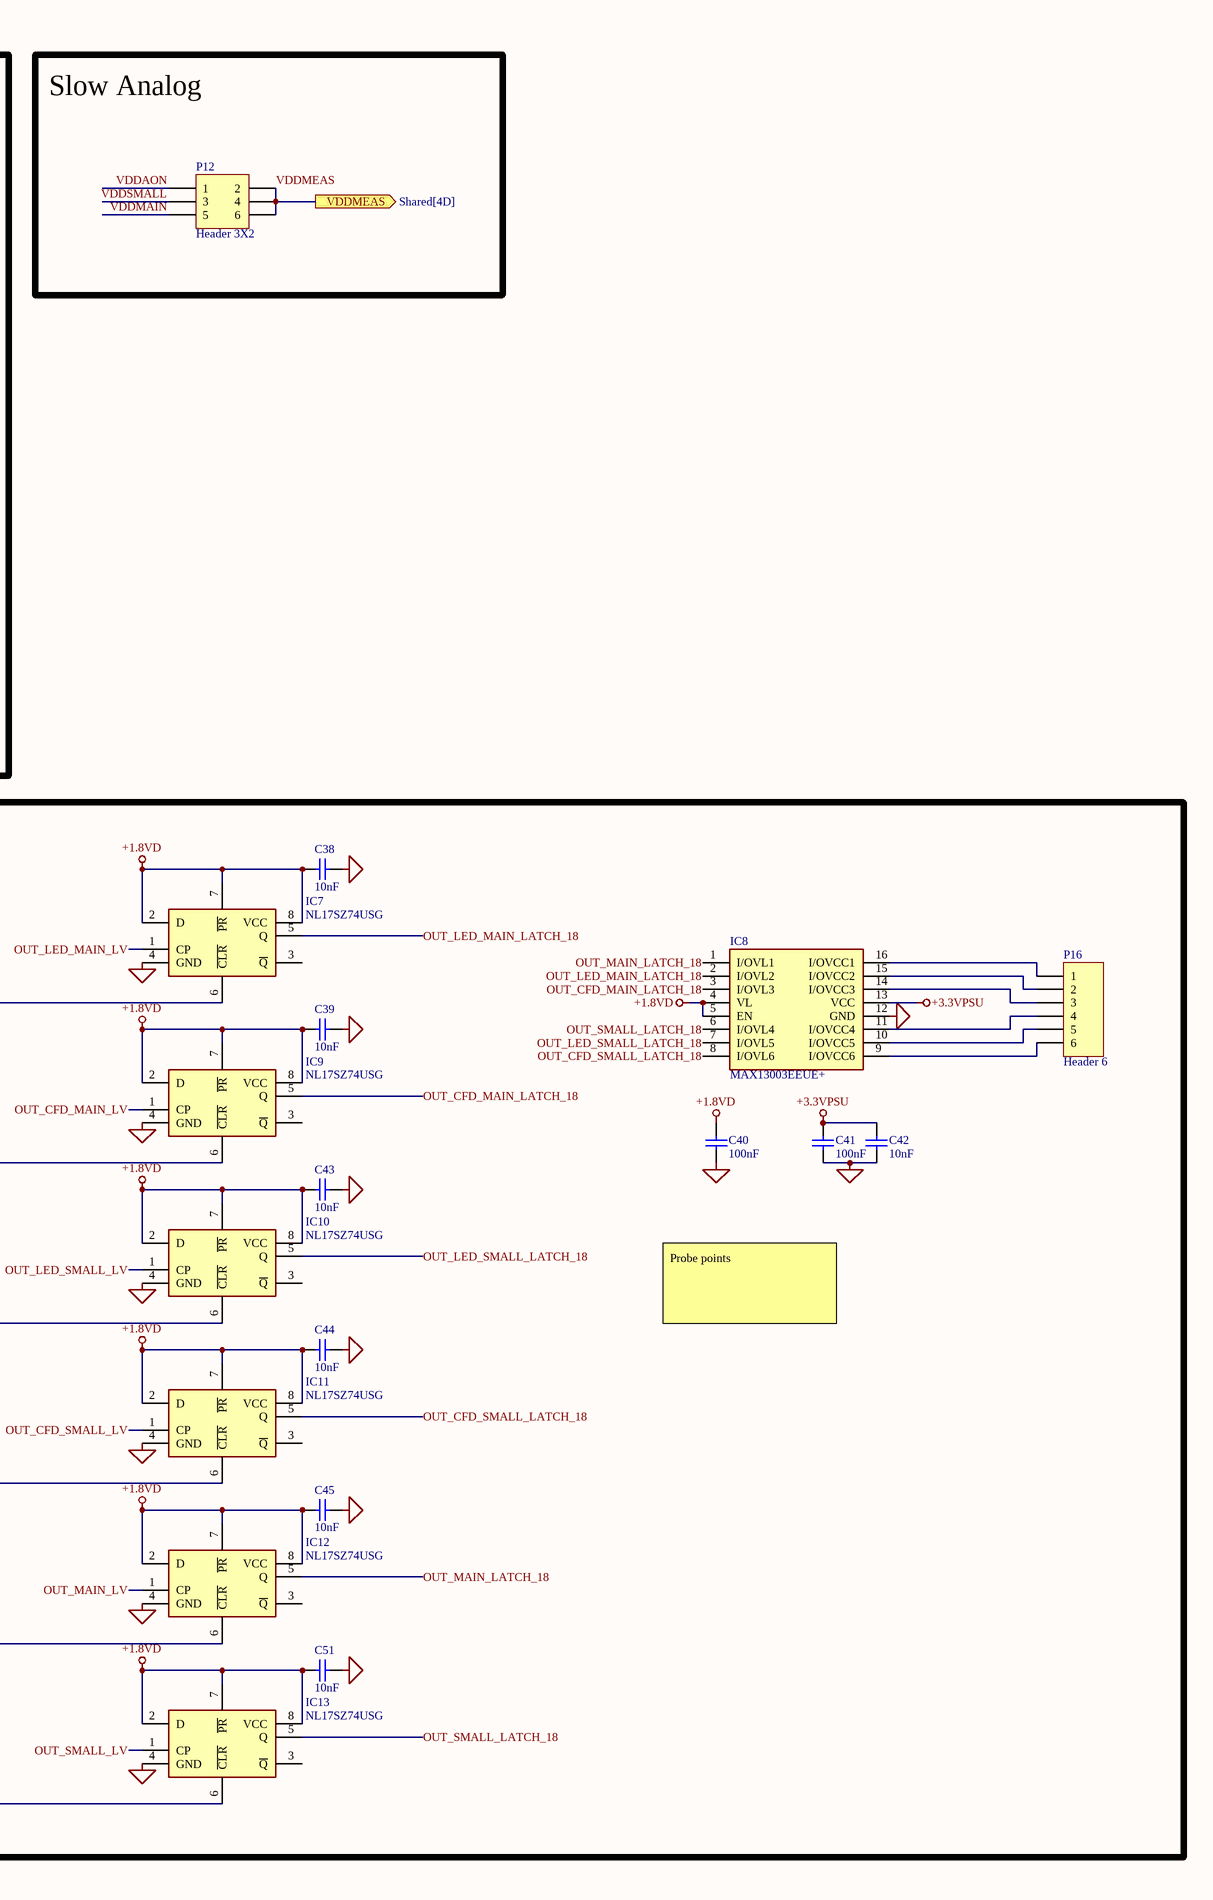
[diagram p5: Channel.SchDoc, right]

### Parts
C31  2-3pF  [CAPC1608X90X35ML10T15]
C32  100nF  [CAPC1608X90X35ML10T15]
C33  1uF  [CAPC1608X90X35ML10T15]
C34  1uF  [CAPC1608X90X35ML10T15]
C35  100nF  [CAPC1608X90X35ML10T15]
C36  1uF  [CAPC1608X90X35ML10T15]
C37  1uF  [CAPC1608X90X35ML10T15]
C38  10nF  [CAPC1608X90X35ML10T15]
C39  10nF  [CAPC1608X90X35ML10T15]
C40  100nF  [CAPC1608X90X35ML10T15]
C41  100nF  [CAPC1608X90X35ML10T15]
C42  10nF  [CAPC1608X90X35ML10T15]
C43  10nF  [CAPC1608X90X35ML10T15]
C44  10nF  [CAPC1608X90X35ML10T15]
C45  10nF  [CAPC1608X90X35ML10T15]
C46  10nF  [CAPC1608X90X35ML10T15]
C47  10nF  [CAPC1608X90X35ML10T15]
C48  10nF  [CAPC1608X90X35ML10T15]
C49  10nF  [CAPC1608X90X35ML10T15]
C50  10nF  [CAPC1608X90X35ML10T15]
C51  10nF  [CAPC1608X90X35ML10T15]
C52  10nF  [CAPC1608X90X35ML10T15]
C53  10nF  [CAPC1608X90X35ML10T15]
C54  10nF  [CAPC1608X90X35ML10T15]
C55  10nF  [CAPC1608X90X35ML10T15]
C56  10nF  [CAPC1608X90X35ML10T15]
C57  10nF  [CAPC1608X90X35ML10T15]
C58  10nF  [CAPC1608X90X35ML10T15]
C59  10nF  [CAPC1608X90X35ML10T15]
C60  10nF  [CAPC1608X90X35ML10T15]
C61  10nF  [CAPC1608X90X35ML10T15]
DUT  CFD_Respin_Correct  [QFN50P800X800X80_HS-57N_WIDEVIAS]
IC5  TDC7200PWR  [SOP65P640X120-14N]
IC6  TDC7200PWR  [SOP65P640X120-14N]
IC7  NL17SZ74USG  [SOP50P310X90-8N]
IC8  MAX13003EEUE+  [SOP65P640X110-16N]
IC9  NL17SZ74USG  [SOP50P310X90-8N]
IC10  NL17SZ74USG  [SOP50P310X90-8N]
IC11  NL17SZ74USG  [SOP50P310X90-8N]
IC12  NL17SZ74USG  [SOP50P310X90-8N]
IC13  NL17SZ74USG  [SOP50P310X90-8N]
J1  5-1814832-1  [TECO-5-1814832-1_V]
J2  5-1814832-1  [TECO-5-1814832-1_V]
J3  5-1814832-1  [TECO-5-1814832-1_V]
J4  5-1814832-1  [TECO-5-1814832-1_V]
J5  5-1814832-1  [TECO-5-1814832-1_V]
J6  5-1814832-1  [TECO-5-1814832-1_V]
J7  5-1814832-1  [TECO-5-1814832-1_V]
J8  5-1814832-1  [TECO-5-1814832-1_V]
P10  Header 1  [Header1]
P11  Header 1  [Header1]
P12  Header 3X2  [HDR2X3]
P13  Header 1  [Header1]
P14  Header 1  [Header1]
P15  Header 1  [Header1]
P16  Header 6  [HDR1X6]
P17  Header 1  [Header1]
P18  Header 1  [Header1]
P19  Header 2  [HDR1X2]
P20  Header 2  [HDR1X2]
P21  Header 2  [HDR1X2]
P22  Header 2  [HDR1X2]
P23  Header 2  [HDR1X2]
P24  Header 2  [HDR1X2]
R2  (50Ohm)  [RESC1609X50X30NL8T20]
R3  (50Ohm)  [RESC1609X50X30NL8T20]
R4  (50Ohm)  [RESC1609X50X30NL8T20]
R5  (50Ohm)  [RESC1609X50X30NL8T20]
R6  <50Ohm  [RESC1609X50X30NL8T20]
R7  (50Ohm)  [RESC1609X50X30NL8T20]
R8  (50Ohm)  [RESC1609X50X30NL8T20]
R9  <50Ohm  [RESC1609X50X30NL8T20]
R10  (50Ohm)  [RESC1609X50X30NL8T20]
R11  (50Ohm)  [RESC1609X50X30NL8T20]
R12  Resistor L  [RESL]
R13  Resistor L  [RESL]

### Blocks framed on the sheet
Fast Inputs: C31 J1-J8 R2-R5 R7 R8 R10 R11
Single Channel TDCs: C32-C37 IC5 IC6 P10 P11 P13 P14 R6 R9
Slow Analog: P12
Intermediate Outputs: C38-C45 C51 IC7-IC13 P16
Power and Decap: C46-C50 C52-C61 P19-P24

### Ports
OUT_MAIN_HV_DUAL (out, see Shared[4D]), OUT_SMALL_HV_DUAL (out, see Shared[4D]), RST_PK_TEST_18 (in, see Shared[2D]), RSTb_RETIME_18 (in, see Shared[2D]), SCAN_CLK_18 (in, see Shared[2D]), SCAN_INb_18 (in, see Shared[2D]), SCAN_LOADb_18 (in, see Shared[2D]), SCAN_OUTb_18 (out, see Shared[4D]), SPI_CLK_MAIN_SINGLE_33 (in, see Shared[2D]), SPI_CLK_SMALL_SINGLE_33 (in, see Shared[2D]), SPI_CSb_MAIN_SINGLE_33 (in, see Shared[2D]), SPI_CSb_SMALL_SINGLE_33 (in, see Shared[2D]), SPI_DIN_33 (in, see Shared[2D]), SPI_DOUT_MAIN_SINGLE_33 (out, see Shared[4D]), SPI_DOUT_SMALL_SINGLE_33 (out, see Shared[4D]), TDC_CLK_MAIN_SINGLE (in, see Shared[2D]), TDC_CLK_SMALL_SINGLE (in, see Shared[2D]), TDC_EN_MAIN_SINGLE_33 (in, see Shared[2D]), TDC_EN_SMALL_SINGLE_33 (in, see Shared[2D]), TDC_INTRb_MAIN_SINGLE_33 (out, see Shared[4D]), TDC_INTRb_SMALL_SINGLE_33 (out, see Shared[4D]), TDC_TRIGG_MAIN_SINGLE_33 (in, see Shared[2D]), TDC_TRIGG_SMALL_SINGLE_33 (in, see Shared[2D]), VBG_TEST (out, see Shared[4D]), VDAC_MAIN (bidir, see Shared[2D]), VDAC_SMALL (bidir, see Shared[2D]), VDDAON (see Shared[2D]), VDDMAIN (see Shared[2D]), VDDMEAS (out, see Shared[4D]), VDDSMALL (see Shared[2D]), VOUT_PK_TEST (out, see Shared[4D]), VREF_ATTEN_MAIN (in, see Shared[2D]), VREF_PREAMP (bidir, see Shared[2D]), VRST_PK_TEST (in, see Shared[2D])

### Nets
+1.8VD: C38.2 C39.2 C40.2 C43.2 C44.2 C45.2 C51.2 IC7.2(D) IC7.7(~{PR}) IC7.8(VCC) IC8.4(VL) IC8.5(EN) IC9.2(D) IC9.7(~{PR}) IC9.8(VCC) IC10.2(D) IC10.7(~{PR}) IC10.8(VCC) IC11.2(D) IC11.7(~{PR}) IC11.8(VCC) IC12.2(D) IC12.7(~{PR}) IC12.8(VCC) IC13.2(D) IC13.7(~{PR}) IC13.8(VCC)
+1.8VDDAON: P19.1
+1.8VDDMAIN: P21.1
+1.8VDDSMALL: P23.1
+1.8VPSU: P20.2 P22.2 P24.2
+3.3VPSU: C32.1 C33.1 C35.1 C36.1 C41.2 C42.2 IC5.14(VDD) IC6.14(VDD) IC8.13(VCC)
GND: C32.2 C33.2 C34.2 C35.2 C36.2 C37.2 C38.1 C39.1 C40.1 C41.1 C42.1 C43.1 C44.1 C45.1 C46.1 C47.1 C48.1 C49.1 C50.1 C51.1 C52.1 C53.1 C54.1 C55.1 C56.1 C57.1 C58.1 C59.1 C60.1 C61.1 DUT.7(VSS) DUT.13(VSS) DUT.19(VSS) DUT.30(VSS) DUT.42(VSS) DUT.43(VSS) DUT.50(VSS) DUT.56(VSS) IC5.7(GND) IC6.7(GND) IC7.4(GND) IC8.12(GND) IC9.4(GND) IC10.4(GND) IC11.4(GND) IC12.4(GND) IC13.4(GND) J1.2 J1.3 J1.4 J1.5 J2.2 J2.3 J2.4 J2.5 J3.2 J3.3 J3.4 J3.5 J4.2 J4.3 J4.4 J4.5 J5.2 J5.3 J5.4 J5.5 J6.2 J6.3 J6.4 J6.5 J7.2 J7.3 J7.4 J7.5 J8.2 J8.3 J8.4 J8.5 R2.1 R3.1 R4.1 R5.1 R7.1 R8.1 R10.1 R11.1
VDDHV: C52.2 C53.2 C54.2 DUT.8(VDDHV) DUT.17(VDDHV) DUT.54(VDDHV)
VDDTEST: C61.2 DUT.23(VDDTEST)
IIN: C31.1 J1.1 R2.2
IIN_COUPLE: C31.2 DUT.48(IIN)
OUT_CFD_MAIN_LATCH_18: IC8.3(I/OVL3) IC9.5(Q)
OUT_CFD_MAIN_LV: DUT.39(OUT_CFD_MAIN_LV) IC9.1(CP)
OUT_CFD_SMALL_LATCH_18: IC8.8(I/OVL6) IC11.5(Q)
OUT_CFD_SMALL_LV: DUT.31(OUT_CFD_SMALL_LV) IC11.1(CP)
OUT_LED_MAIN_LATCH_18: IC7.5(Q) IC8.2(I/OVL2)
OUT_LED_MAIN_LV: DUT.40(OUT_LED_MAIN_LV) IC7.1(CP)
OUT_LED_SMALL_LATCH_18: IC8.7(I/OVL5) IC10.5(Q)
OUT_LED_SMALL_LV: DUT.32(OUT_LED_SMALL_LV) IC10.1(CP)
OUT_MAIN_HV: DUT.46(OUT_MAIN_HV) R12.1
OUT_MAIN_HV_DUAL: R12.2 ; port OUT_MAIN_HV_DUAL
OUT_MAIN_HV_SINGLE: IC5.4(STOP) R12.3
OUT_MAIN_LATCH_18: IC8.1(I/OVL1) IC12.5(Q)
OUT_MAIN_LV: DUT.45(OUT_MAIN_LV) IC12.1(CP)
OUT_SMALL_HV: DUT.33(OUT_SMALL_HV) R13.1
OUT_SMALL_HV_DUAL: R13.2 ; port OUT_SMALL_HV_DUAL
OUT_SMALL_HV_SINGLE: IC6.4(STOP) R13.3
OUT_SMALL_LATCH_18: IC8.6(I/OVL4) IC13.5(Q)
OUT_SMALL_LV: DUT.34(OUT_SMALL_LV) IC13.1(CP)
RST_PK_TEST_18: DUT.10(RST_PK) ; port RST_PK_TEST_18
RSTb_RETIME_18: IC7.6(~{CLR}) IC9.6(~{CLR}) IC10.6(~{CLR}) IC11.6(~{CLR}) IC12.6(~{CLR}) IC13.6(~{CLR}) ; port RSTb_RETIME_18
SCAN_CLK_18: DUT.28(SCAN_CLK) ; port SCAN_CLK_18
SCAN_INb_18: DUT.15(SCAN_INb) ; port SCAN_INb_18
SCAN_LOADb_18: DUT.16(SCAN_LOADb) ; port SCAN_LOADb_18
SCAN_OUTb_18: DUT.29(SCAN_OUTb) ; port SCAN_OUTb_18
SPI_CLK_MAIN_SINGLE_33: IC5.12(SCLK) ; port SPI_CLK_MAIN_SINGLE_33
SPI_CLK_SMALL_SINGLE_33: IC6.12(SCLK) ; port SPI_CLK_SMALL_SINGLE_33
SPI_CSb_MAIN_SINGLE_33: IC5.11(CSB) ; port SPI_CSb_MAIN_SINGLE_33
SPI_CSb_SMALL_SINGLE_33: IC6.11(CSB) ; port SPI_CSb_SMALL_SINGLE_33
SPI_DIN_33: IC5.10(DIN) IC6.10(DIN) P11.1 P14.1 ; port SPI_DIN_33
SPI_DOUT_MAIN_SINGLE_33: IC5.9(DOUT) ; port SPI_DOUT_MAIN_SINGLE_33
SPI_DOUT_SMALL_SINGLE_33: IC6.9(DOUT) ; port SPI_DOUT_SMALL_SINGLE_33
TDC_CLK_MAIN_SINGLE: IC5.5(CLOCK) P10.1 ; port TDC_CLK_MAIN_SINGLE
TDC_CLK_SMALL_SINGLE: IC6.5(CLOCK) P13.1 ; port TDC_CLK_SMALL_SINGLE
TDC_EN_MAIN_SINGLE_33: IC5.1(ENABLE) ; port TDC_EN_MAIN_SINGLE_33
TDC_EN_SMALL_SINGLE_33: IC6.1(ENABLE) ; port TDC_EN_SMALL_SINGLE_33
TDC_INTRb_MAIN_SINGLE_33: IC5.8(INTB) ; port TDC_INTRb_MAIN_SINGLE_33
TDC_INTRb_SMALL_SINGLE_33: IC6.8(INTB) ; port TDC_INTRb_SMALL_SINGLE_33
TDC_START_MAIN: J6.1 R6.1 R8.2
TDC_START_SMALL: J8.1 R9.1 R11.2
TDC_TRIGG_MAIN_SINGLE_33: IC5.2(TRIGG) ; port TDC_TRIGG_MAIN_SINGLE_33
TDC_TRIGG_SMALL_SINGLE_33: IC6.2(TRIGG) ; port TDC_TRIGG_SMALL_SINGLE_33
VBG_TEST: C55.2 DUT.21(VBG) ; port VBG_TEST
VDAC_MAIN: C57.2 DUT.2(VDAC_MAIN) ; port VDAC_MAIN
VDAC_SMALL: C56.2 DUT.4(VDAC_SMALL) ; port VDAC_SMALL
VDDAON: C46.2 C47.2 C48.2 C49.2 DUT.6(VDDAON) DUT.12(VDDAON) DUT.18(VDDAON) DUT.53(VDDAON) P12.1 P19.2 P20.1 ; port VDDAON
VDDMAIN: C50.2 DUT.41(VDDMAIN) P12.5 P21.2 P22.1 ; port VDDMAIN
VDDMEAS: P12.2 P12.4 P12.6 ; port VDDMEAS
VDDSMALL: C60.2 DUT.38(VDDSMALL) P12.3 P23.2 P24.1 ; port VDDSMALL
VIN_DELAY_TEST: DUT.25(VIN_DELAY) J2.1 R3.2
VIN_PK_TEST: DUT.24(VIN_PK) J4.1 R5.2
VINN_ZCD_SMALL: DUT.36(VINN_ZCD_SMALL) J5.1 R7.2
VINP_LED_SMALL: DUT.37(VINP_LED_SMALL) J3.1 R4.2
VINP_ZCD_SMALL: DUT.35(VINP_ZCD_SMALL) J7.1 R10.2
VOUT_DELAY_TEST: DUT.26(VOUT_DELAY) P17.1
VOUT_PK_TEST: DUT.22(VOUT_PK) ; port VOUT_PK_TEST
VREF_ATTEN_MAIN: C59.2 DUT.51(VREF_ATTEN_MAIN) P15.1 ; port VREF_ATTEN_MAIN
VREF_PREAMP: C58.2 DUT.1(VREF_PREAMP) ; port VREF_PREAMP
VRST_PK_TEST: DUT.27(VRST_PK_TEST) P18.1 ; port VRST_PK_TEST
NetC34_1: C34.1 IC5.13(VREG)
NetC37_1: C37.1 IC6.13(VREG)
NetIC5_3: IC5.3(START) R6.2
NetIC6_3: IC6.3(START) R9.2
NetIC8_9: IC8.9(I/OVCC6) P16.6
NetIC8_10: IC8.10(I/OVCC5) P16.5
NetIC8_11: IC8.11(I/OVCC4) P16.4
NetIC8_14: IC8.14(I/OVCC3) P16.3
NetIC8_15: IC8.15(I/OVCC2) P16.2
NetIC8_16: IC8.16(I/OVCC1) P16.1

Not connected (* = marked no-connect by the designer): DUT 3(NC) 5(NC) 9(NC) 11(NC) 14(NC) 20(NC) 44(NC) 47(NC) 49(NC) 52(NC) 55(NC); IC5 6(NC); IC6 6(NC); IC7 3(~{Q}); IC9 3(~{Q}); IC10 3(~{Q}); IC11 3(~{Q}); IC12 3(~{Q}); IC13 3(~{Q})

### Channels
x0: designators end in _x0; ports OUT_MAIN_HV_DUAL=OUT_MAIN_HV_DUAL0 OUT_SMALL_HV_DUAL=OUT_SMALL_HV_DUAL0 RST_PK_TEST_18=RST_PK_TEST_18 RSTb_RETIME_18=RSTb_RETIME_18 SCAN_CLK_18=SCAN_CLK_180 SCAN_INb_18=SCAN_INb_18 SCAN_LOADb_18=SCAN_LOADb_180 SCAN_OUTb_18=SCAN_OUTb_180 SPI_CLK_MAIN_SINGLE_33=SPI_CLK_MAIN_SINGLE_330 SPI_CLK_SMALL_SINGLE_33=SPI_CLK_SMALL_SINGLE_330 SPI_CSb_MAIN_SINGLE_33=SPI_CSb_MAIN_SINGLE_330 SPI_CSb_SMALL_SINGLE_33=SPI_CSb_SMALL_SINGLE_330 SPI_DIN_33=SPI_DIN_33 SPI_DOUT_MAIN_SINGLE_33=SPI_DOUT_MAIN_SINGLE_330 SPI_DOUT_SMALL_SINGLE_33=SPI_DOUT_SMALL_SINGLE_330 TDC_CLK_MAIN_SINGLE=TDC_CLK_MAIN_SINGLE TDC_CLK_SMALL_SINGLE=TDC_CLK_SMALL_SINGLE TDC_EN_MAIN_SINGLE_33=TDC_EN_MAIN_SINGLE_330 TDC_EN_SMALL_SINGLE_33=TDC_EN_SMALL_SINGLE_330 TDC_INTRb_MAIN_SINGLE_33=TDC_INTRb_MAIN_SINGLE_330 TDC_INTRb_SMALL_SINGLE_33=TDC_INTRb_SMALL_SINGLE_330 TDC_TRIGG_MAIN_SINGLE_33=TDC_TRIGG_MAIN_SINGLE_330 TDC_TRIGG_SMALL_SINGLE_33=TDC_TRIGG_SMALL_SINGLE_330 VBG_TEST=VBG_TEST VDAC_MAIN=VDAC_MAIN VDAC_SMALL=VDAC_SMALL VDDAON=VDDAON_x0 VDDMAIN=VDDMAIN_x0 VDDMEAS=VDDMEAS VDDSMALL=VDDSMALL_x0 VOUT_PK_TEST=VOUT_PK_TEST0 VREF_ATTEN_MAIN=VREF_ATTEN_MAIN_x0 VREF_PREAMP=VREF_PREAMP VRST_PK_TEST=VRST_PK_TEST0
x1: designators end in _x1; ports OUT_MAIN_HV_DUAL=OUT_MAIN_HV_DUAL1 OUT_SMALL_HV_DUAL=OUT_SMALL_HV_DUAL1 RST_PK_TEST_18=RST_PK_TEST_18 RSTb_RETIME_18=RSTb_RETIME_18 SCAN_CLK_18=SCAN_CLK_181 SCAN_INb_18=SCAN_INb_18 SCAN_LOADb_18=SCAN_LOADb_181 SCAN_OUTb_18=SCAN_OUTb_181 SPI_CLK_MAIN_SINGLE_33=SPI_CLK_MAIN_SINGLE_331 SPI_CLK_SMALL_SINGLE_33=SPI_CLK_SMALL_SINGLE_331 SPI_CSb_MAIN_SINGLE_33=SPI_CSb_MAIN_SINGLE_331 SPI_CSb_SMALL_SINGLE_33=SPI_CSb_SMALL_SINGLE_331 SPI_DIN_33=SPI_DIN_33 SPI_DOUT_MAIN_SINGLE_33=SPI_DOUT_MAIN_SINGLE_331 SPI_DOUT_SMALL_SINGLE_33=SPI_DOUT_SMALL_SINGLE_331 TDC_CLK_MAIN_SINGLE=TDC_CLK_MAIN_SINGLE TDC_CLK_SMALL_SINGLE=TDC_CLK_SMALL_SINGLE TDC_EN_MAIN_SINGLE_33=TDC_EN_MAIN_SINGLE_331 TDC_EN_SMALL_SINGLE_33=TDC_EN_SMALL_SINGLE_331 TDC_INTRb_MAIN_SINGLE_33=TDC_INTRb_MAIN_SINGLE_331 TDC_INTRb_SMALL_SINGLE_33=TDC_INTRb_SMALL_SINGLE_331 TDC_TRIGG_MAIN_SINGLE_33=TDC_TRIGG_MAIN_SINGLE_331 TDC_TRIGG_SMALL_SINGLE_33=TDC_TRIGG_SMALL_SINGLE_331 VBG_TEST=VBG_TEST VDAC_MAIN=VDAC_MAIN VDAC_SMALL=VDAC_SMALL VDDAON=VDDAON_x1 VDDMAIN=VDDMAIN_x1 VDDMEAS=VDDMEAS VDDSMALL=VDDSMALL_x1 VOUT_PK_TEST=VOUT_PK_TEST1 VREF_ATTEN_MAIN=VREF_ATTEN_MAIN_x1 VREF_PREAMP=VREF_PREAMP VRST_PK_TEST=VRST_PK_TEST1

### Notes on the sheet
- May need to ensure trace impedance
- Pick one resistor
- Probe points
- (near P20) A via near the chip for every supply
- At least one cap per chip pad, place as close as possible

### Library data of the parts
C31 = CMP-2000-04945-1: 0603,2-3pF; Manufacturer: Murata; Capacitance: 22pF; Tolerance (%): ±5%; Rated Voltage: 50V; Dielectric: C0G; Manufacturer URL: http://www.murata.com/; Datasheet Version: Jul-06; Package Reference: 603; Case Size/Dimension: 0603; Package Description: 2-Pin Surface Mount Device, Body 1.6 x 0.8 mm; Datasheet URL: https://datasheet.ciiva.com/11786/0900766b807a1cab-11786398.pdf
C32 C35 C40 C41 = CMP-2000-04945-1: as C20 on sheet Shared; Manufacturer URL: http://www.murata.com/; Datasheet Version: Jul-06; Package Reference: 603; Case Size/Dimension: 0603; Package Description: 2-Pin Surface Mount Device, Body 1.6 x 0.8 mm; Datasheet URL: https://datasheet.ciiva.com/11786/0900766b807a1cab-11786398.pdf
C33 C34 C36 C37 = CMP-2000-04945-1: as C19 on sheet Shared; Manufacturer URL: http://www.murata.com/; Datasheet Version: Jul-06; Package Reference: 603; Case Size/Dimension: 0603; Package Description: 2-Pin Surface Mount Device, Body 1.6 x 0.8 mm; Datasheet URL: https://datasheet.ciiva.com/11786/0900766b807a1cab-11786398.pdf
C38 C39 C42-C61 = CMP-2000-04945-1: as C1 on sheet Shared; Manufacturer URL: http://www.murata.com/; Datasheet Version: Jul-06; Package Reference: 603; Case Size/Dimension: 0603; Package Description: 2-Pin Surface Mount Device, Body 1.6 x 0.8 mm; Datasheet URL: https://datasheet.ciiva.com/11786/0900766b807a1cab-11786398.pdf
IC5 IC6 = TDC7200PWR: as IC1 on sheet Shared; Datasheet Link: http://www.ti.com/lit/gpn/tdc7200; Height: 1.2mm; Manufacturer_Part_Number: TDC7200PWR
IC7 IC9-IC13 = NL17SZ74USG: Flip Flops 1.65-5.5V CMOS Single D-Type; Manufacturer_Name: ON Semiconductor; Datasheet Link: http://www.onsemi.com/pub/Collateral/NL17SZ74-D.PDF; Height: 0.9mm; Manufacturer_Part_Number: NL17SZ74USG
IC8 = MAX13003EEUE+: as IC3 on sheet Shared; Datasheet Link: https://pdfserv.maximintegrated.com/en/ds/MAX13000E-MAX13005E.pdf; Height: 1.1mm; Manufacturer_Part_Number: MAX13003EEUE+
J1-J8 = CMP-2000-05415-1: SMA Connector, Pitch 5.08 mm, 1 Position, Height 9.5 mm, Tail Length 4 mm, -65 to 165 degC, RoHS, Bulk; Manufacturer: TE Connectivity; Connector Mounting: PCBMount; Connector Body Style: StraightJack; Impedance: 50ohm; Coaxial Termination: Solder; SVHC: NoSVHC(15-Jun-2015); Frequency Max: 3GHz; Product Range: ZDCSeries; Connector Type: SMACoaxial; Datasheet Version: Rev. B1, 03/2011; Package Reference: 5-1814832-1; Package Description: SMA Connector, Pitch 5.08 mm, 1 Position, Height 9.5 mm, Tail Length 4 mm; Contact Plating: GoldPlatedContacts; Coaxial Cable Types: -; Contact Material: BerylliumCopper; Manufacturer URL: http://www.te.com/; Datasheet URL: http://www.onlinecomponents.com/productFiles/mf-AMP/eng_cd_1814832_a.pdf
P12 = Header 3X2: Header, 3-Pin, Dual row; LatestRevisionDate: 17-Jul-2002; LatestRevisionNote: Re-released for DXP Platform.; Publisher: Altium Limited
P16 = Header 6: Header, 6-Pin; LatestRevisionDate: 17-Jul-2002; LatestRevisionNote: Re-released for DXP Platform.; Publisher: Altium Limited
P19-P24 = Header 2: Header, 2-Pin; LatestRevisionDate: 17-Jul-2002; LatestRevisionNote: Re-released for DXP Platform.; Publisher: Altium Limited
R2-R5 R7 R8 R10 R11 = CMP-2000-03816-5: 0603,(50Ohm),Do Not Populate; Manufacturer: Vishay Semiconductor; Voltage Rating: 75 V; Package Quantity: 5000; DatasheetVersion: 06/2012; Min Operating Temperature: -55 degC; ComponentLink1URL: http://www.vishay.com/; Mounting Technology: Surface Mount; Height: 0.45 mm; ComponentLink1Description: Manufacturer URL; REACH SVHC: Unknown; PackageReference: 0603; Packaging: Tape and Reel; Max Operating Temperature: 155 degC; Mount: Surface Mount; ComponentLink2Description: Datasheet; PackageDescription: 2-Pin Surface Mount Device, Body 1.575 x 0.85 mm; Length: 1.55 mm; ComponentLink2URL: http://www.vishay.com/docs/20035/dcrcwe3.pdf; Pins: 2; RoHSCompliant: true
R6 R9 = CMP-2000-03816-5: as R1 on sheet Shared; Package Quantity: 5000; DatasheetVersion: 06/2012; Min Operating Temperature: -55 degC; ComponentLink1URL: http://www.vishay.com/; Mounting Technology: Surface Mount; Height: 0.45 mm; ComponentLink1Description: Manufacturer URL; REACH SVHC: Unknown; PackageReference: 0603; Packaging: Tape and Reel; Max Operating Temperature: 155 degC; Mount: Surface Mount; ComponentLink2Description: Datasheet; PackageDescription: 2-Pin Surface Mount Device, Body 1.575 x 0.85 mm; Length: 1.55 mm; ComponentLink2URL: http://www.vishay.com/docs/20035/dcrcwe3.pdf; Pins: 2; RoHSCompliant: true
R12 R13 = Resistor L: Pick one 0603,0Ohm

## Nets that join several sheets
+1.8VD: Shared (C2.1 P1.2 U1.5), x0 (27 pins), x1 (27 pins)
+1.8VDDAON: Shared (C14.1 U5.5), x0 (P19_x0.1), x1 (P19_x1.1)
+1.8VDDMAIN: Shared (C8.1 U3.5), x0 (P21_x0.1), x1 (P21_x1.1)
+1.8VDDSMALL: Shared (C10.1 U4.5), x0 (P23_x0.1), x1 (P23_x1.1)
+1.8VPSU: Shared (P1.1 P2.1 P5.2), x0 (P20_x0.2 P22_x0.2 P24_x0.2), x1 (P20_x1.2 P22_x1.2 P24_x1.2)
+3.3VPSU: Shared (38 pins), x0 (9 pins), x1 (9 pins)
GND: Shared (54 pins), x0 (87 pins), x1 (87 pins)
VDDHV: Shared (P3.2), x0 (6 pins), x1 (6 pins)
VDDTEST: Shared (P4.2 P5.1), x0 (C61_x0.2 DUT_x0.23), x1 (C61_x1.2 DUT_x1.23)
OUT_MAIN_HV_DUAL0: Shared (IC1.3), x0 (R12_x0.2)
OUT_MAIN_HV_DUAL1: Shared (IC1.4), x1 (R12_x1.2)
OUT_SMALL_HV_DUAL0: Shared (IC2.3), x0 (R13_x0.2)
OUT_SMALL_HV_DUAL1: Shared (IC2.4), x1 (R13_x1.2)
RST_PK_TEST_18: Shared (IC3.8), x0 (DUT_x0.10), x1 (DUT_x1.10)
RSTb_RETIME_18: Shared (IC3.1), x0 (6 pins), x1 (6 pins)
SCAN_CLK_180: Shared (IC3.3), x0 (DUT_x0.28)
SCAN_CLK_181: Shared (IC4.3), x1 (DUT_x1.28)
SCAN_INb_18: Shared (IC3.7), x0 (DUT_x0.15), x1 (DUT_x1.15)
SCAN_LOADb_180: Shared (IC3.6), x0 (DUT_x0.16)
SCAN_LOADb_181: Shared (IC4.6), x1 (DUT_x1.16)
SCAN_OUTb_180: Shared (IC3.2), x0 (DUT_x0.29)
SCAN_OUTb_181: Shared (IC4.2), x1 (DUT_x1.29)
SPI_CLK_MAIN_SINGLE_330: Shared (uP1.40), x0 (IC5_x0.12)
SPI_CLK_MAIN_SINGLE_331: Shared (uP1.3), x1 (IC5_x1.12)
SPI_CLK_SMALL_SINGLE_330: Shared (uP1.17/RX2), x0 (IC6_x0.12)
SPI_CLK_SMALL_SINGLE_331: Shared (uP1.13), x1 (IC6_x1.12)
SPI_CSb_MAIN_SINGLE_330: Shared (uP1.38), x0 (IC5_x0.11)
SPI_CSb_MAIN_SINGLE_331: Shared (uP1.4), x1 (IC5_x1.11)
SPI_CSb_SMALL_SINGLE_330: Shared (uP1.18/TX1), x0 (IC6_x0.11)
SPI_CSb_SMALL_SINGLE_331: Shared (uP1.12), x1 (IC6_x1.11)
SPI_DIN_33: Shared (5 pins), x0 (IC5_x0.10 IC6_x0.10 P11_x0.1 P14_x0.1), x1 (IC5_x1.10 IC6_x1.10 P11_x1.1 P14_x1.1)
SPI_DOUT_MAIN_SINGLE_330: Shared (uP1.46), x0 (IC5_x0.9)
SPI_DOUT_MAIN_SINGLE_331: Shared (uP1.15/RX3), x1 (IC5_x1.9)
SPI_DOUT_SMALL_SINGLE_330: Shared (uP1.19/RX1), x0 (IC6_x0.9)
SPI_DOUT_SMALL_SINGLE_331: Shared (uP1.11), x1 (IC6_x1.9)
TDC_CLK_MAIN_SINGLE: Shared (R18.1), x1 (IC5_x1.5 P10_x1.1)
TDC_CLK_MAIN_SINGLE: Shared (R1.1), x0 (IC5_x0.5 P10_x0.1)
TDC_CLK_SMALL_SINGLE: Shared (R15.1), x1 (IC6_x1.5 P13_x1.1)
TDC_CLK_SMALL_SINGLE: Shared (R17.1), x0 (IC6_x0.5 P13_x0.1)
TDC_EN_MAIN_SINGLE_330: Shared (uP1.44), x0 (IC5_x0.1)
TDC_EN_MAIN_SINGLE_331: Shared (uP1.14/TX3), x1 (IC5_x1.1)
TDC_EN_SMALL_SINGLE_330: Shared (uP1.24), x0 (IC6_x0.1)
TDC_EN_SMALL_SINGLE_331: Shared (uP1.8), x1 (IC6_x1.1)
TDC_INTRb_MAIN_SINGLE_330: Shared (uP1.48), x0 (IC5_x0.8)
TDC_INTRb_MAIN_SINGLE_331: Shared (uP1.16/TX2), x1 (IC5_x1.8)
TDC_INTRb_SMALL_SINGLE_330: Shared (uP1.20/SDA), x0 (IC6_x0.8)
TDC_INTRb_SMALL_SINGLE_331: Shared (uP1.10), x1 (IC6_x1.8)
TDC_TRIGG_MAIN_SINGLE_330: Shared (uP1.42), x0 (IC5_x0.2)
TDC_TRIGG_MAIN_SINGLE_331: Shared (uP1.2), x1 (IC5_x1.2)
TDC_TRIGG_SMALL_SINGLE_330: Shared (uP1.22), x0 (IC6_x0.2)
TDC_TRIGG_SMALL_SINGLE_331: Shared (uP1.9), x1 (IC6_x1.2)
VBG_TEST: Shared (uP1.64/A10/ADC10), x0 (C55_x0.2 DUT_x0.21)
VBG_TEST: Shared (uP1.55/A1/ADC1), x1 (C55_x1.2 DUT_x1.21)
VDAC_MAIN: Shared (uP1.62/A8/ADC8), x0 (C57_x0.2 DUT_x0.2)
VDAC_MAIN: Shared (uP1.57/A3/ADC3), x1 (C57_x1.2 DUT_x1.2)
VDAC_SMALL: Shared (uP1.61/A7/ADC7), x0 (C56_x0.2 DUT_x0.4)
VDAC_SMALL: Shared (uP1.56/A2/ADC2), x1 (C56_x1.2 DUT_x1.4)
VDDMEAS: Shared (uP1.60/A6/ADC6), x0 (P12_x0.2 P12_x0.4 P12_x0.6)
VDDMEAS: Shared (uP1.59/A5/ADC5), x1 (P12_x1.2 P12_x1.4 P12_x1.6)
VOUT_PK_TEST0: Shared (uP1.65/A11/ADC11), x0 (DUT_x0.22)
VOUT_PK_TEST1: Shared (uP1.54/A0/ADC0), x1 (DUT_x1.22)
VREF_PREAMP: Shared (uP1.63/A9/ADC9), x0 (C58_x0.2 DUT_x0.1)
VREF_PREAMP: Shared (uP1.58/A4/ADC4), x1 (C58_x1.2 DUT_x1.1)